# EAGLE design LedSample (EAGLE 5.11)
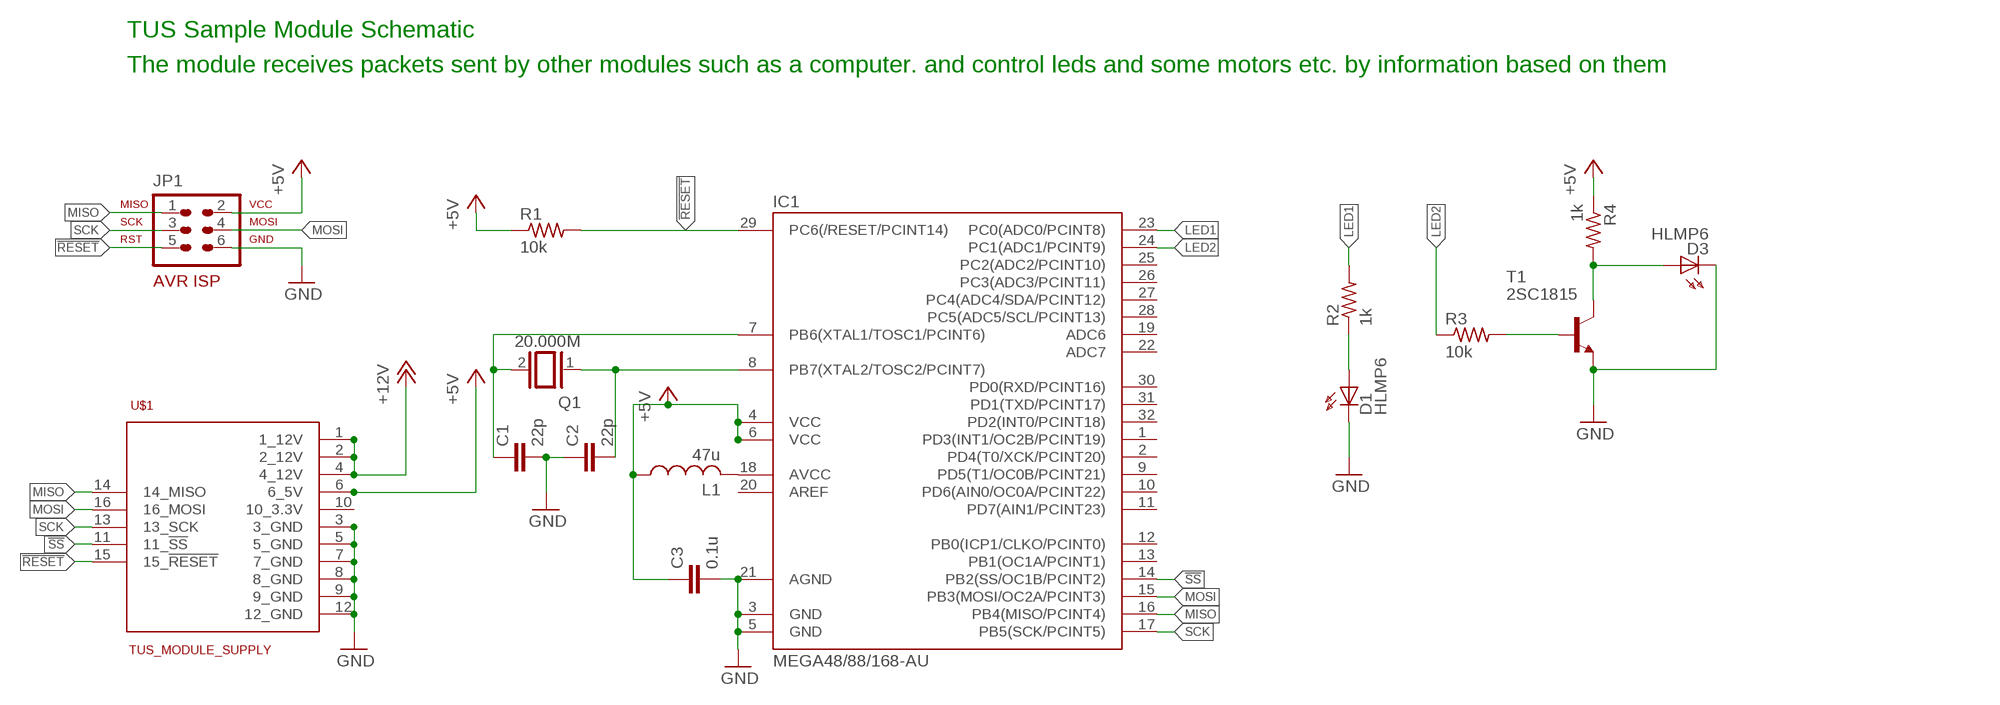
[diagram p0: schematic, sheet 1]

## Parts
C1  22p  C2.5/4  [C2.5-4]
C2  22p  C2.5/4  [C2.5-4]
C3  0.1u  C2.5/4  [C2.5-4]
D1  HLMP6  [HLMP6]
D3  HLMP6  [HLMP6]
IC1  MEGA48/88/168-AU  [TQFP32-08]
JP1  AVR-ISP-6HORZ  [AVR-ISP-6R]
L1  47u  L-US0204/7  [0204/7]
Q1  20.000M  XTAL/S  [QS]
R1  10k  R-US_0207/7  [0207/7]
R2  1k  R-US_0204/7  [0204/7]
R3  10k  R-US_0207/7  [0207/7]
R4  1k  R-US_0204/7  [0204/7]
T1  2SC1815  [TO92-ECB]
U$1  TUS_MODULE_SUPPLY  [2X08]

## Nets
!RESET: IC1.29(PC6(/RESET/PCINT14)) JP1.5 R1.2 U$1.15(15_!RESET)
!SS: IC1.14(PB2(SS/OC1B/PCINT2)) U$1.11(11_!SS)
+5V: C3.1 IC1.4(VCC) IC1.6(VCC) JP1.2 L1.1 R1.1 R4.1 U$1.6(6_5V)
+12V: U$1.1(1_12V) U$1.2(2_12V) U$1.4(4_12V)
GND: C1.2 C2.1 C3.2 D1.K D3.K IC1.3(GND) IC1.5(GND) IC1.21(AGND) JP1.6 T1.E U$1.3(3_GND) U$1.5(5_GND) U$1.7(7_GND) U$1.8(8_GND) U$1.9(9_GND) U$1.12(12_GND)
LED1: IC1.23(PC0(ADC0/PCINT8)) R2.2
LED2: IC1.24(PC1(ADC1/PCINT9)) R3.1
MISO: IC1.16(PB4(MISO/PCINT4)) JP1.1 U$1.14(14_MISO)
MOSI: IC1.15(PB3(MOSI/OC2A/PCINT3)) JP1.4 U$1.16(16_MOSI)
N$1: D1.A R2.1
N$2: IC1.18(AVCC) L1.2
N$3: C1.1 IC1.7(PB6(XTAL1/TOSC1/PCINT6)) Q1.2
N$4: C2.2 IC1.8(PB7(XTAL2/TOSC2/PCINT7)) Q1.1
N$5: D3.A R4.2 T1.C
N$6: R3.2 T1.B
SCK: IC1.17(PB5(SCK/PCINT5)) JP1.3 U$1.13(13_SCK)
Unconnected: IC1.1(PD3(INT1/OC2B/PCINT19)) IC1.2(PD4(T0/XCK/PCINT20)) IC1.9(PD5(T1/OC0B/PCINT21)) IC1.10(PD6(AIN0/OC0A/PCINT22)) IC1.11(PD7(AIN1/PCINT23)) IC1.12(PB0(ICP1/CLKO/PCINT0)) IC1.13(PB1(OC1A/PCINT1)) IC1.19(ADC6) IC1.20(AREF) IC1.22(ADC7) IC1.25(PC2(ADC2/PCINT10)) IC1.26(PC3(ADC3/PCINT11)) IC1.27(PC4(ADC4/SDA/PCINT12)) IC1.28(PC5(ADC5/SCL/PCINT13)) IC1.30(PD0(RXD/PCINT16)) IC1.31(PD1(TXD/PCINT17)) IC1.32(PD2(INT0/PCINT18)) U$1.10(10_3.3V)

## Notes on the sheet
- TUS Sample Module Schematic
- The module receives packets sent by other modules such as a computer. and control leds and some motors etc. by information based on them

## Library data of the parts
C1-C3 = capacitor-wima:C: CAPACITOR naming: grid - package width
D1 D3 = display-hp:HLMP6: LED 2mm horizontal; MF: AGILENT TECHNOLOGIES; MPN: HLMP-6500; OC_FARNELL: 1652490; OC_NEWARK: 40K0088
IC1 = avr-7:MEGA48/88/168
JP1 = avr-7:AVR-ISP-6: AVR ISP-6 Serial Programming Header
L1 = rcl:L-US: INDUCTOR, American symbol
Q1 = special:XTAL/S: CRYSTAL
R1-R4 = rcl:R-US_: RESISTOR, American symbol
T1 = myparts:2SC1815: NPN EPITAXIAL TRANSISTOR Source: TOSHIBA .. 2SC1815 1.pdf
U$1 = tus:TUS_MODULE_SUPPLY

## Board
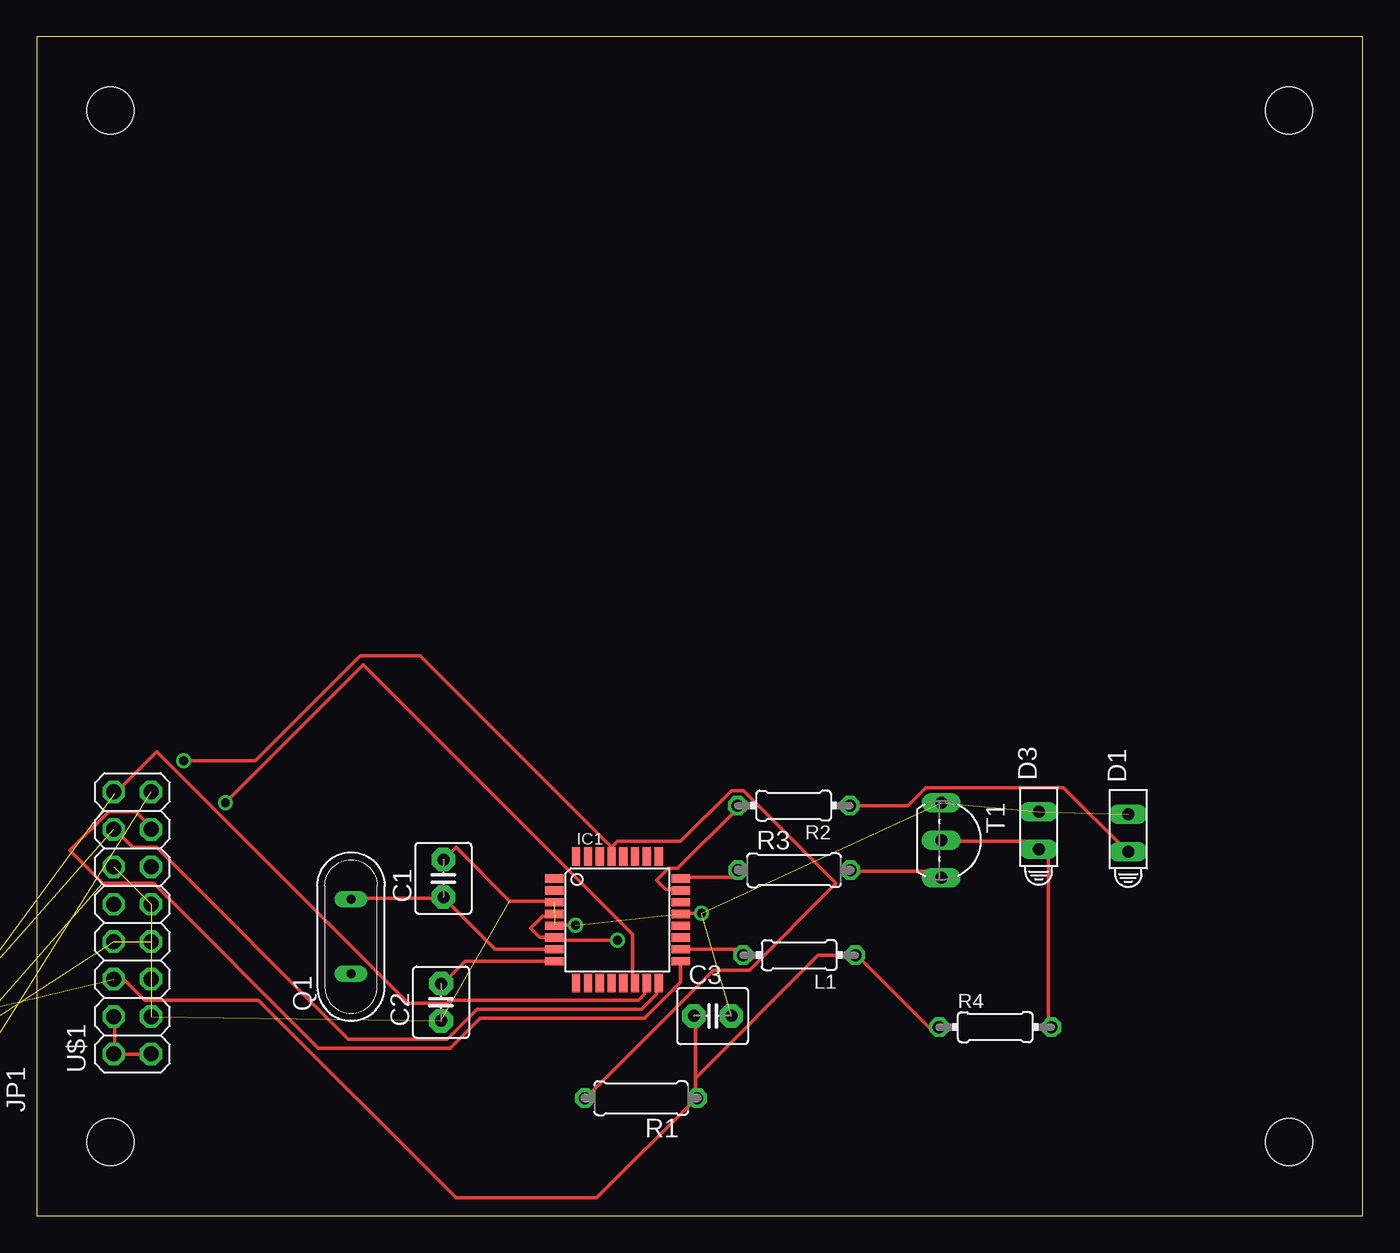
[diagram p1: board, top side]
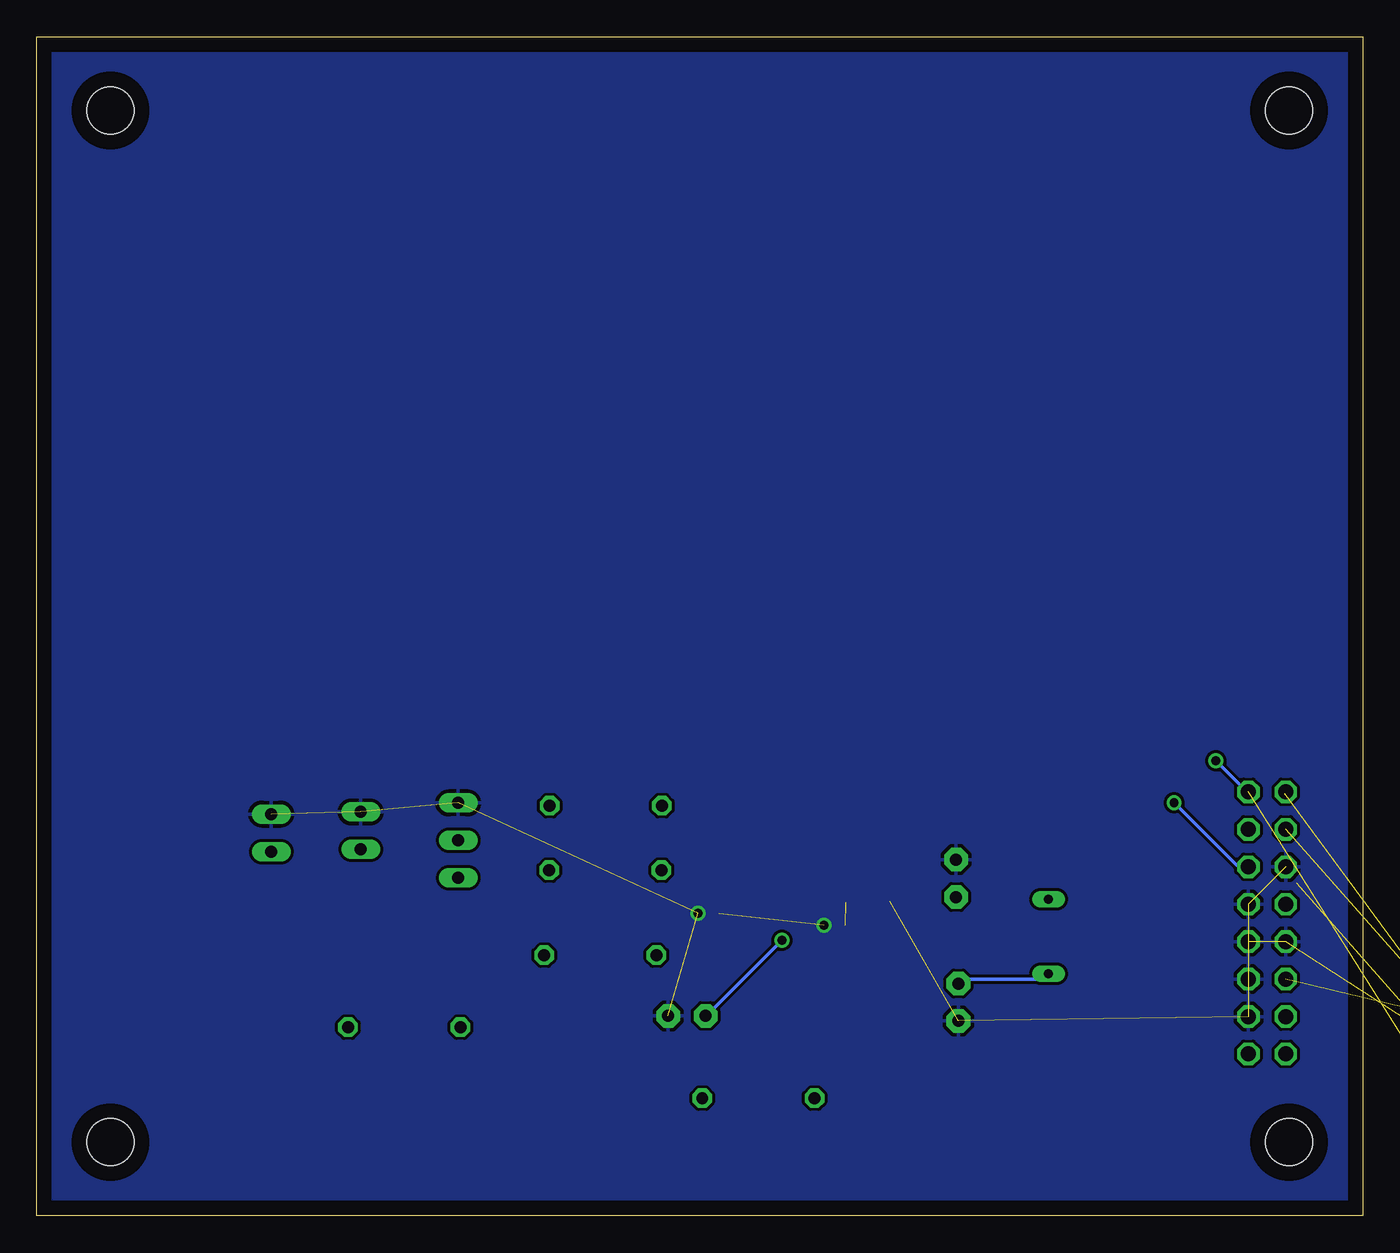
[diagram p2: board, bottom side, seen from below]

Size 90 x 80 mm. Coordinates in mm from the lower left corner, seen from the top.
Outline: 0,0 90,0 90,80 0,80 0,0
Copper layers (1*16): Top 0.035mm / dielectric 1.5mm / Bottom 0.035mm
Design rules "default": minimum track width 10mil, minimum drill 24mil, track to track 8mil, track to pad 8mil, pad to pad 8mil, via to via 8mil, smd to smd 8mil, copper to edge 40mil, drill to drill 8mil, minimum pad ring 10mil, minimum via ring 8mil, stop-mask expansion 4mil, vias tented up to drill 0mil, thermal gap 10mil
Holes 3.2 mm at 5,5 85,5 5,75 85,75

### Footprints (pad centres in the part's own frame; a part is rotated, then mirrored left to right if it is on the bottom)
C2.5-4 = drill 0.813 pad 1.6 octagon: 1 -1.27,0; 2 1.27,0
HLMP6 = drill 0.813 long: A -1.27,0; K 1.27,0
TQFP32-08 = smd 1.27 x 0.559: 1 -4.293,2.8; 2 -4.293,2; 3 -4.293,1.2; 4 -4.293,0.4; 5 -4.293,-0.4; 6 -4.293,-1.2; 7 -4.293,-2; 8 -4.293,-2.8; 17 4.293,-2.8; 18 4.293,-2; 19 4.293,-1.2; 20 4.293,-0.4; 21 4.293,0.4; 22 4.293,1.2; 23 4.293,2; 24 4.293,2.8 | smd 0.559 x 1.27: 9 -2.8,-4.293; 10 -2,-4.293; 11 -1.2,-4.293; 12 -0.4,-4.293; 13 0.4,-4.293; 14 1.2,-4.293; 15 2,-4.293; 16 2.8,-4.293; 25 2.8,4.293; 26 2,4.293; 27 1.2,4.293; 28 0.4,4.293; 29 -0.4,4.293; 30 -1.2,4.293; 31 -2,4.293; 32 -2.8,4.293
AVR-ISP-6R = drill 1.016 square: 1 -2.54,-1.27 | drill 1.016 octagon: 2 -2.54,1.27; 3 0,-1.27; 4 0,1.27; 5 2.54,-1.27; 6 2.54,1.27
0204/7 = drill 0.813 octagon: 1 -3.81,0; 2 3.81,0
QS = drill 0.61 long: 1 -2.54,0; 2 2.54,0
0207/7 = drill 0.813 octagon: 1 -3.81,0; 2 3.81,0
TO92-ECB = drill 0.813 long: B 2.54,0; C 0,0; E -2.54,0
2X08 = drill 1.016 octagon: 1 -8.89,-1.27; 2 -8.89,1.27; 3 -6.35,-1.27; 4 -6.35,1.27; 5 -3.81,-1.27; 6 -3.81,1.27; 7 -1.27,-1.27; 8 -1.27,1.27; 9 1.27,-1.27; 10 1.27,1.27; 11 3.81,-1.27; 12 3.81,1.27; 13 6.35,-1.27; 14 6.35,1.27; 15 8.89,-1.27; 16 8.89,1.27

### Placement (x,y rotation side)
C1  27.6,22.9 90 top
C2  27.44,14.49 90 top
C3  45.87,13.56 0 top
D1  74.09,25.98 90 top
D3  68.01,26.14 90 top
IC1  39.41,20.08 0 top
JP1  -6.5,11.38 0 top  (outside the outline)
L1  51.75,17.69 180 top
Q1  21.33,18.95 90 top
R1  41.02,7.98 180 top
R2  51.37,27.83 180 top
R3  51.41,23.45 0 top
R4  65.06,12.8 0 top
T1  61.4,25.48 270 top
U$1  6.49,19.87 90 top

### Tracks (layer width: path | path; a pad name or v marks a point on that pad's centre or on a via)
!RESET  (via drill 0.61)  (1 unrouted)
  Top 0.254: 39.01,24.99 39.01,24.38 IC1.29 39.01,24.99 | 39.01,24.99 39.42,25.4 43.69,25.4 47.14,28.85 47.95,28.85 54.25,22.55 48.36,16.66 45.92,16.66 37.39,8.13 R1.2 | v9.96,30.89 14.83,30.89 21.95,38 26.01,38 39.01,24.99
  Bottom 0.254: v9.96,30.89 7.92,28.85 U$1.15
!SS  (via drill 0.61)
  Top 0.254: v12.8,28.04 22.15,37.39 40.44,19.1 40.44,15.85 IC1.14
  Bottom 0.254: v12.8,28.04 8.53,23.77 7.92,23.77 U$1.11
+5V  (via drill 0.61)  (1 unrouted)
  Top 0.254: R4.1 61.16,12.6 60.96,12.39 55.68,17.68 L1.1 55.47,17.68 53.03,17.68 44.7,9.35 | IC1.4 34.95,20.32 34.34,20.32 33.53,19.51 34.14,18.9 34.95,18.9 IC1.6 35.15,18.69 v39.42,18.69 | 44.7,9.35 44.7,13.41 C3.1 | 44.7,9.35 44.7,8.13 R1.1 44.7,7.92 38,1.22 28.45,1.22 15.04,14.63 7.32,14.63 5.89,16.05 5.28,16.05 U$1.6
  Bottom 0.254: v39.42,18.69 44.5,13.61 C3.1
+12V
  Top 0.254: U$1.4 5.28,13.41 5.28,11.18 U$1.2 5.28,10.97 7.72,10.97 U$1.1
GND  (via drill 0.61)  (14 unrouted)
  Top 0.254: v36.58,19.71 35.15,19.71 IC1.5 | IC1.3 34.95,21.34 32.11,21.34 28.45,24.99 27.64,24.18 C1.2 | v45.11,20.52 43.89,20.52 IC1.21
  pour Bottom: 0,80.06 0,0 90.22,0 90.22,80.06
LED1
  Top 0.254: IC1.23 43.69,22.15 42.67,22.15 42.06,22.76 42.88,23.57 43.48,23.57 47.55,27.64 R2.2
LED2
  Top 0.254: IC1.24 43.89,22.96 47.14,22.96 47.55,23.37 R3.1
MISO  (1 unrouted)
  Top 0.254: IC1.16 42.06,15.65 42.06,15.04 41.05,14.02 29.87,14.02 27.84,11.99 21.13,11.99 8.13,24.99 6.5,24.99 5.28,26.21 U$1.14
MOSI  (1 unrouted)
  Top 0.254: IC1.15 41.25,15.65 41.25,15.04 40.84,14.63 28.04,14.63 27.84,14.43 25.2,14.43 8.13,31.5 5.28,28.65 U$1.16
N$1
  Top 0.254: R2.1 55.27,27.84 59.13,27.84 60.35,29.06 69.7,29.06 73.97,24.79 D1.A
N$2
  Top 0.254: IC1.18 43.89,18.09 47.55,18.09 47.75,17.88 L1.2
N$3
  Top 0.254: IC1.7 34.95,18.09 31.09,18.09 27.64,21.54 C1.1 27.43,21.54 21.34,21.54 Q1.2
N$4
  Top 0.254: IC1.8 34.95,17.27 29.06,17.27 27.64,15.85 C2.2
  Bottom 0.254: Q1.1 21.34,16.26 21.54,16.05 27.23,16.05 27.43,15.85 C2.2
N$5
  Top 0.254: R4.2 68.68,12.8 68.68,24.18 68.07,24.79 D3.A 67.87,24.99 67.46,25.4 61.57,25.4 T1.C
N$6
  Top 0.254: R3.2 55.27,23.37 60.96,23.37 61.37,22.96 T1.B
SCK  (1 unrouted)
  Top 0.254: IC1.17 43.69,17.27 43.69,15.85 41.25,13.41 30.07,13.41 28.04,11.38 19.1,11.38 7.92,22.55 4.47,22.55 2.23,24.79 4.88,27.43 6.71,27.43 7.72,26.42 U$1.13